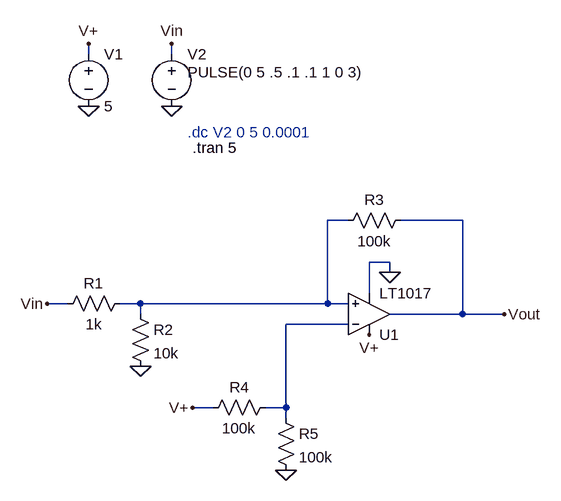
[diagram p0: schematic 08H-02.asc]
08H-02.asc, the LTspice schematic file:
Version 4.1
SHEET 1 880 680
WIRE -160 -224 -160 -240
WIRE -32 -224 -32 -240
WIRE 240 32 208 32
WIRE 416 32 320 32
WIRE 304 96 272 96
WIRE 304 112 304 96
WIRE 272 144 272 96
WIRE -192 160 -224 160
WIRE -80 160 -112 160
WIRE 208 160 208 32
WIRE 208 160 -80 160
WIRE 240 160 208 160
WIRE -80 176 -80 160
WIRE 416 176 416 32
WIRE 416 176 304 176
WIRE 480 176 416 176
WIRE 240 192 144 192
WIRE 32 320 0 320
WIRE 144 320 144 192
WIRE 144 320 112 320
WIRE 144 336 144 320
FLAG 304 112 0
FLAG 272 208 V+
FLAG 144 416 0
FLAG -80 256 0
FLAG -224 160 Vin
FLAG 480 176 Vout
FLAG 0 320 V+
FLAG -160 -144 0
FLAG -32 -144 0
FLAG -160 -240 V+
FLAG -32 -240 Vin
SYMBOL Comparators\\LT1017 272 176 M180
SYMATTR InstName U1
SYMBOL res -96 144 R90
WINDOW 0 0 56 VBottom 2
WINDOW 3 32 56 VTop 2
SYMATTR InstName R1
SYMATTR Value 1k
SYMBOL res -96 160 R0
SYMATTR InstName R2
SYMATTR Value 10k
SYMBOL res 336 16 R90
WINDOW 0 0 56 VBottom 2
WINDOW 3 32 56 VTop 2
SYMATTR InstName R3
SYMATTR Value 100k
SYMBOL res 128 304 R90
WINDOW 0 0 56 VBottom 2
WINDOW 3 32 56 VTop 2
SYMATTR InstName R4
SYMATTR Value 100k
SYMBOL res 128 320 R0
SYMATTR InstName R5
SYMATTR Value 100k
SYMBOL voltage -160 -240 R0
WINDOW 123 0 0 Left 0
WINDOW 39 0 0 Left 0
SYMATTR InstName V1
SYMATTR Value 5
SYMBOL voltage -32 -240 R0
WINDOW 3 24 44 Left 2
WINDOW 123 0 0 Left 0
WINDOW 39 0 0 Left 0
SYMATTR InstName V2
SYMATTR Value PULSE(0 5 .5 .1 .1 1 0 3)
TEXT -8 -104 Left 2 ;.dc V2 0 5 0.0001
TEXT 0 -80 Left 2 !.tran 5

The netlist it stands for:
* 08H-02.asc
X§U1 N001 N002 V+ 0 Vout LT1017  ; pins In+ In- V+ V- OUT
R1 N001 Vin 1k
R2 N001 0 10k
R3 Vout N001 100k
R4 N002 V+ 100k
R5 N002 0 100k
V1 V+ 0 5
V2 Vin 0 PULSE(0 5 .5 .1 .1 1 0 3)
* .dc V2 0 5 0.0001
.tran 5
.backanno
.end